# Altium schematic sheet Sheet1.SchDoc
size A3
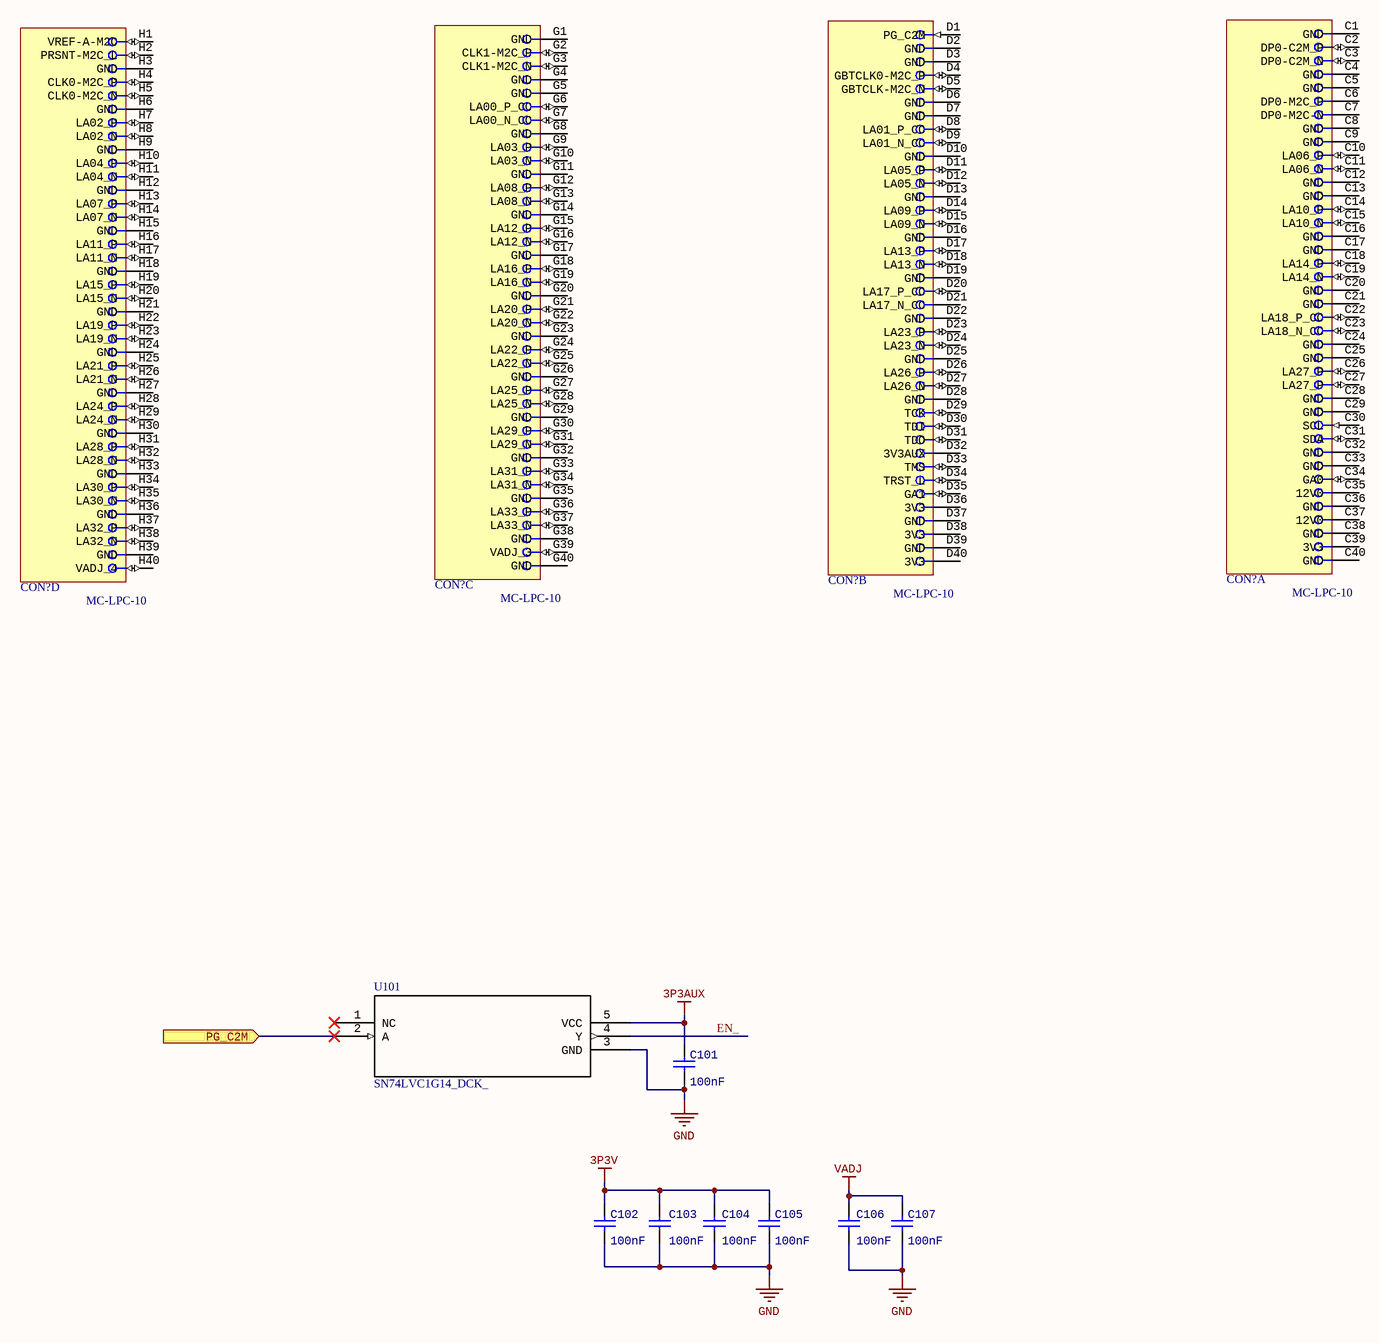
[diagram p0: Sheet1.SchDoc]

## Parts
(Parts that share a designator on the sheet are numbered #1, #2 ... from top to bottom, then left to right.)
C101  value 100nF  [RAD-0.3]  (hidden comment: Cap)
C102  value 100nF  [RAD-0.3]  (hidden comment: Cap)
C103  value 100nF  [RAD-0.3]  (hidden comment: Cap)
C104  value 100nF  [RAD-0.3]  (hidden comment: Cap)
C105  value 100nF  [RAD-0.3]  (hidden comment: Cap)
C106  value 100nF  [RAD-0.3]  (hidden comment: Cap)
C107  value 100nF  [RAD-0.3]  (hidden comment: Cap)
CON?#1  MC-LPC-10  [ASP-134604-01]  (part B of 4)
CON?#2  MC-LPC-10  [ASP-134604-01]  (part A of 4)
CON?#3  MC-LPC-10  [ASP-134604-01]  (part D of 4)
CON?#4  MC-LPC-10  [ASP-134604-01]  (part C of 4)
U101  SN74LVC1G14_DCK_  [DCK5]

## Ports
PG_C2M (in)

## Nets
3P3AUX: C101.2 U101.5(VCC)
3P3V: C102.2 C103.2 C104.2 C105.2
GND: C101.1 C102.1 C103.1 C104.1 C105.1 C106.1 C107.1 U101.3(GND)
VADJ: C106.2 C107.2
EN_: U101.4(Y)
PG_C2M: U101.2(A) ; port PG_C2M

Not connected (* = marked no-connect by the designer): CON?#1 D1(PG_C2M) D2(GND) D3(GND) D4(GBTCLK0-M2C_P) D5(GBTCLK-M2C_N) D6(GND) D7(GND) D8(LA01_P_CC) D9(LA01_N_CC) D10(GND) D11(LA05_P) D12(LA05_N) D13(GND) D14(LA09_P) D15(LA09_N) D16(GND) D17(LA13_P) D18(LA13_N) D19(GND) D20(LA17_P_CC) D21(LA17_N_CC) D22(GND) D23(LA23_P) D24(LA23_N) D25(GND) D26(LA26_P) D27(LA26_N) D28(GND) D29(TCK) D30(TDI) D31(TDO) D32(3V3AUX) D33(TMS) D34(TRST_L) D35(GA1) D36(3V3) D37(GND) D38(3V3) D39(GND) D40(3V3); CON?#2 C1(GND) C2(DP0-C2M_P) C3(DP0-C2M_N) C4(GND) C5(GND) C6(DP0-M2C_P) C7(DP0-M2C-N) C8(GND) C9(GND) C10(LA06_P) C11(LA06_N) C12(GND) C13(GND) C14(LA10_P) C15(LA10_N) C16(GND) C17(GND) C18(LA14_P) C19(LA14_N) C20(GND) C21(GND) C22(LA18_P_CC) C23(LA18_N_CC) C24(GND) C25(GND) C26(LA27_P) C27(LA27_P) C28(GND) C29(GND) C30(SCL) C31(SDA) C32(GND) C33(GND) C34(GA0) C35(12V0) C36(GND) C37(12V0) C38(GND) C39(3V3) C40(GND); CON?#3 H1(VREF-A-M2C) H2(PRSNT-M2C_L) H3(GND) H4(CLK0-M2C_P) H5(CLK0-M2C_N) H6(GND) H7(LA02_P) H8(LA02_N) H9(GND) H10(LA04_P) H11(LA04_N) H12(GND) H13(LA07_P) H14(LA07_N) H15(GND) H16(LA11_P) H17(LA11_N) H18(GND) H19(LA15_P) H20(LA15_N) H21(GND) H22(LA19_P) H23(LA19_N) H24(GND) H25(LA21_P) H26(LA21_N) H27(GND) H28(LA24_P) H29(LA24_N) H30(GND) H31(LA28_P) H32(LA28_N) H33(GND) H34(LA30_P) H35(LA30_N) H36(GND) H37(LA32_P) H38(LA32_N) H39(GND) H40(VADJ_4); CON?#4 G1(GND) G2(CLK1-M2C_P) G3(CLK1-M2C_N) G4(GND) G5(GND) G6(LA00_P_CC) G7(LA00_N_CC) G8(GND) G9(LA03_P) G10(LA03_N) G11(GND) G12(LA08_P) G13(LA08_N) G14(GND) G15(LA12_P) G16(LA12_N) G17(GND) G18(LA16_P) G19(LA16_N) G20(GND) G21(LA20_P) G22(LA20_N) G23(GND) G24(LA22_P) G25(LA22_N) G26(GND) G27(LA25_P) G28(LA25_N) G29(GND) G30(LA29_P) G31(LA29_N) G32(GND) G33(LA31_P) G34(LA31_N) G35(GND) G36(LA33_P) G37(LA33_N) G38(GND) G39(VADJ_3) G40(GND); U101 1(NC)*

## Library data of the parts
C101-C107 = Cap: Capacitor; Published: 8-Jun-2000; LatestRevisionDate: 17-Jul-2002; LatestRevisionNote: Re-released for DXP Platform.; PackageReference: RAD-0.3; Publisher: Altium Limited; PackageDescription: Radial Cap, Thru-Hole; 2 Leads; 0.3 in Pin Spacing
CON?#1-CON?#4 = CONNECTOR_VITA57_LPC: Connector VITA57 LPC; Manufacturer: Samtec; Specific: 4x40 contacts, stack height 10 mm; Type: Terminal (Module Side); Part Description: Connector VITA57 LPC; Part Number: ASP-134604-01; Distributor: Sibalco, Samtec; Distributor Part Number: ASP-134604-01; Value: MC-LPC-10; Supplier 1: Digi-Key; Supplier Part Number 1: SAM8732-ND
U101 = SN74LVC1G14_DCK_: Imported; Manufacturer: Texas Instruments; Manufacturer_Part_Number: sn74lvc1g14_dck_5; INDUSTRY_STD_PKG_TYPE: SC70; FAMILY_NAME: LL INVERTER; PIN_COUNT: 5; PACKAGE_DESIGNATOR: DCK; Datasheet URL: http://www.ti.com/lit/gpn/SN74LVC1G14; GENERIC_PART_NUMBER: SN74LVC1G14; Vendor: Texas Instruments; RefDes: RefDes; Type: DEV; Value: Value